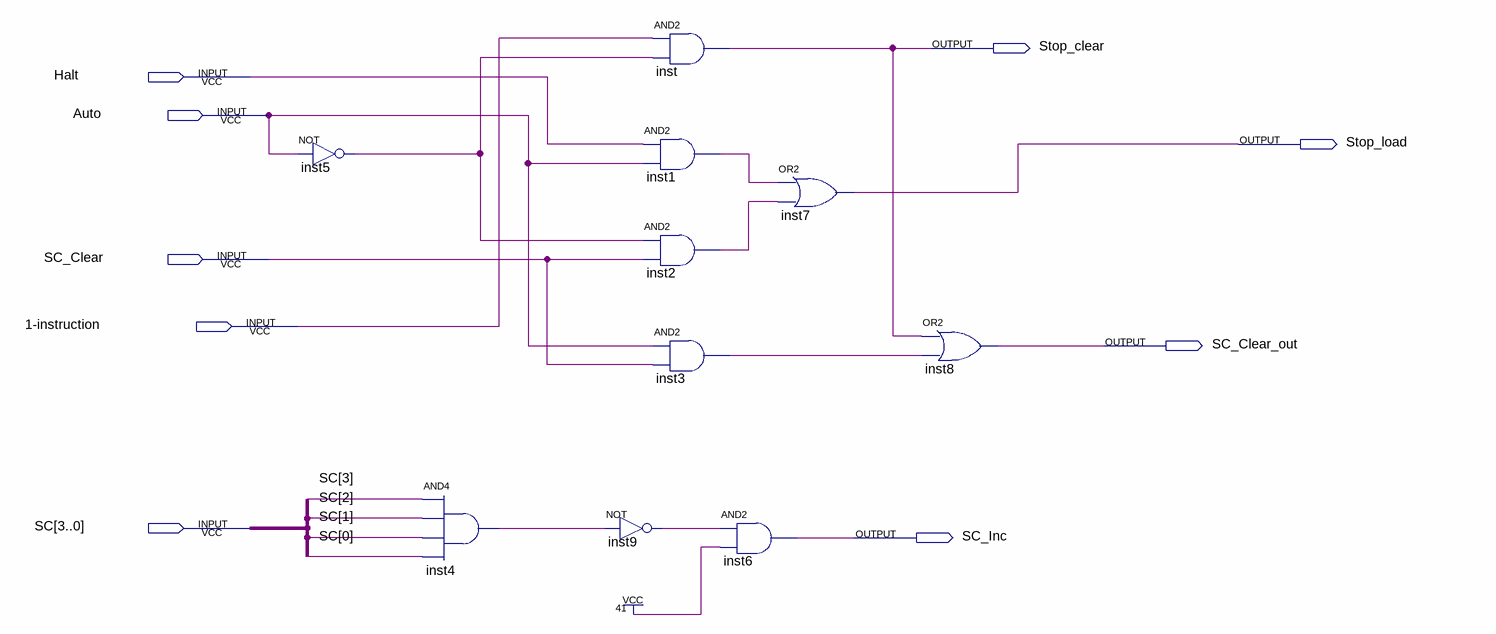
[diagram p0: schematic sheet]
// Quartus schematic sc_ctrl.bdf as structural Verilog: 10 symbols, 9 pins
module sc_ctrl (
  input  Halt,
  input  Auto,
  input  SC_Clear,
  input  \1-instruction ,
  input  [3:0] SC,
  output Stop_clear,
  output Stop_load,
  output SC_Clear_out,
  output SC_Inc
);

  wire inst1_out, inst2_out, inst3_out, inst4_out, inst5_out, inst9_out;

  not inst5 (inst5_out, Auto);
  and inst4 (inst4_out, SC[3], SC[2], SC[1], SC[0]);
  not inst9 (inst9_out, inst4_out);
  and inst (Stop_clear, \1-instruction , inst5_out);
  and inst1 (inst1_out, Halt, Auto);
  and inst2 (inst2_out, inst5_out, SC_Clear);
  and inst3 (inst3_out, Auto, SC_Clear);
  or inst7 (Stop_load, inst1_out, inst2_out);
  and inst6 (SC_Inc, inst9_out, 1'b1);
  or inst8 (SC_Clear_out, Stop_clear, inst3_out);
endmodule
